# Altium schematic sheet RadioPod_2.SchDoc
size A4
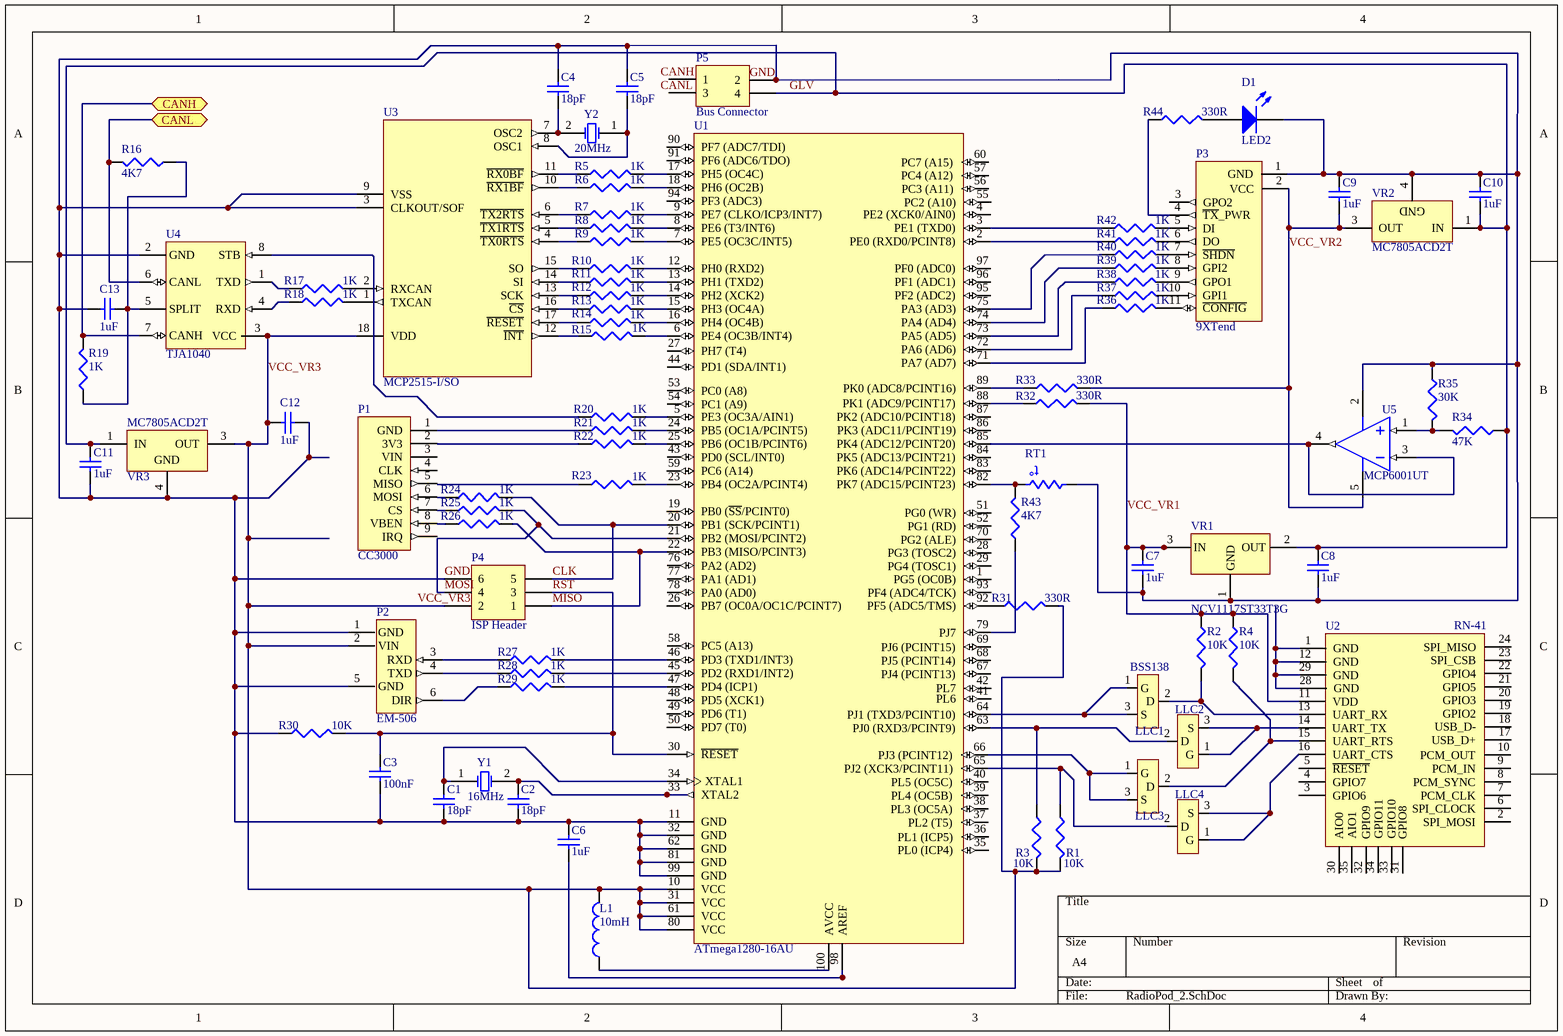
[diagram p0: RadioPod_2.SchDoc]

## Parts
C1  value 18pF  [1608[0603]]  (hidden comment: Cap Semi)
C2  value 18pF  [1608[0603]]  (hidden comment: Cap Semi)
C3  value 100nF  [1608[0603]]  (hidden comment: Cap Semi)
C4  value 18pF  [1608[0603]]  (hidden comment: Cap Semi)
C5  value 18pF  [1608[0603]]  (hidden comment: Cap Semi)
C6  value 1uF  [1608[0603]]  (hidden comment: Cap Semi)
C7  value 1uF  [1608[0603]]  (hidden comment: Cap Semi)
C8  value 1uF  [1608[0603]]  (hidden comment: Cap Semi)
C9  value 1uF  [1608[0603]]  (hidden comment: Cap Semi)
C10  value 1uF  [1608[0603]]  (hidden comment: Cap Semi)
C11  value 1uF  [1608[0603]]  (hidden comment: Cap Semi)
C12  value 1uF  [1608[0603]]  (hidden comment: Cap Semi)
C13  value 1uF  [1608[0603]]  (hidden comment: Cap Semi)
D1  LED2  [3.2X1.6X1.1]
L1  value 10mH  [0402-A]  (hidden comment: Inductor)
LLC1  BSS138  [SOT-23]
LLC2  BSS138  [SOT-23]  (value not drawn)
LLC3  BSS138  [SOT-23]  (value not drawn)
LLC4  BSS138  [SOT-23]  (value not drawn)
P1  CC3000  [hdr1X9]
P2  EM-506  [EM_506]
P3  9XTend  [9XTend Header]
P4  ISP Header  [HDR2X3]
P5  Bus Connector  [HDR2X2]
R1  value 10K  [J1-0603]  (hidden comment: Res3)
R2  value 10K  [J1-0603]  (hidden comment: Res3)
R3  value 10K  [J1-0603]  (hidden comment: Res3)
R4  value 10K  [J1-0603]  (hidden comment: Res3)
R5  value 1K  [J1-0603]  (hidden comment: Res3)
R6  value 1K  [J1-0603]  (hidden comment: Res3)
R7  value 1K  [J1-0603]  (hidden comment: Res3)
R8  value 1K  [J1-0603]  (hidden comment: Res3)
R9  value 1K  [J1-0603]  (hidden comment: Res3)
R10  value 1K  [J1-0603]  (hidden comment: Res3)
R11  value 1K  [J1-0603]  (hidden comment: Res3)
R12  value 1K  [J1-0603]  (hidden comment: Res3)
R13  value 1K  [J1-0603]  (hidden comment: Res3)
R14  value 1K  [J1-0603]  (hidden comment: Res3)
R15  value 1K  [J1-0603]  (hidden comment: Res3)
R16  value 4K7  [J1-0603]  (hidden comment: Res3)
R17  value 1K  [J1-0603]  (hidden comment: Res3)
R18  value 1K  [J1-0603]  (hidden comment: Res3)
R19  value 1K  [J1-0603]  (hidden comment: Res3)
R20  value 1K  [J1-0603]  (hidden comment: Res3)
R21  value 1K  [J1-0603]  (hidden comment: Res3)
R22  value 1K  [J1-0603]  (hidden comment: Res3)
R23  value 1K  [J1-0603]  (hidden comment: Res3)
R24  value 1K  [J1-0603]  (hidden comment: Res3)
R25  value 1K  [J1-0603]  (hidden comment: Res3)
R26  value 1K  [J1-0603]  (hidden comment: Res3)
R27  value 1K  [J1-0603]  (hidden comment: Res3)
R28  value 1K  [J1-0603]  (hidden comment: Res3)
R29  value 1K  [J1-0603]  (hidden comment: Res3)
R30  value 10K  [J1-0603]  (hidden comment: Res3)
R31  value 330R  [J1-0603]  (hidden comment: Res3)
R32  value 330R  [J1-0603]  (hidden comment: Res3)
R33  value 330R  [J1-0603]  (hidden comment: Res3)
R34  value 47K  [J1-0603]  (hidden comment: Res3)
R35  value 30K  [J1-0603]  (hidden comment: Res3)
R36  value 1K  [J1-0603]  (hidden comment: Res3)
R37  value 1K  [J1-0603]  (hidden comment: Res3)
R38  value 1K  [J1-0603]  (hidden comment: Res3)
R39  value 1K  [J1-0603]  (hidden comment: Res3)
R40  value 1K  [J1-0603]  (hidden comment: Res3)
R41  value 1K  [J1-0603]  (hidden comment: Res3)
R42  value 1K  [J1-0603]  (hidden comment: Res3)
R43  value 4K7  [J1-0603]  (hidden comment: Res3)
R44  value 330R  [J1-0603]  (hidden comment: Res3)
RT1  Res Thermal  [6-0805_N]  (value not drawn)
U1  ATmega1280-16AU  [100A_N]
U2  RN-41  [RN41]
U3  MCP2515-I/SO  [SOIC-SO18_N]
U4  TJA1040  [SO8_L]
U5  MCP6001UT  [SOT-23-OT5_N]
VR1  NCV1117ST33T3G  [SOT223_M]
VR2  MC7805ACD2T  [936-03]
VR3  MC7805ACD2T  [936-03]
Y1  16MHz  [R38]
Y2  20MHz  [R38]

## Ports
CANH (bidir), CANL (bidir)

## Nets
CANH: R19.2 U4.7(CANH) ; port CANH
CANL: R16.2 U4.6(CANL) ; port CANL
CLK: P4.5 R24.2 U1.20(PB1_(SCK/PCINT1))
GLV: C8.2 C10.1 C11.2 P5.4 R34.1 VR1.2(OUT) VR2.1(IN) VR3.1(IN)
GND: C1.1 C2.1 C3.1 C4.2 C5.2 C6.2 C7.1 C8.1 C9.2 C10.2 C11.1 C12.1 C13.1 D1.2(K) P2.1(GND) P2.5(GND) P3.1(GND) P4.6 P5.2 R30.1 R35.1 RT1.2 U1.11(GND) U1.32(GND) U1.62(GND) U1.81(GND) U1.99(GND) U3.3(CLKOUT/SOF) U3.9(VSS) U4.2(GND) U5.2(VSS) VR1.1(GND) VR2.4(GND) VR3.4(GND)
MISO: P4.1 R26.2 U1.22(PB3_(MISO/PCINT3))
MOSI: P4.4 R25.2 U1.21(PB2_(MOSI/PCINT2))
RST: C3.2 P4.3 R30.2 U1.30(~{RESET})
VCC_VR1: C7.2 R2.1 R4.1 R32.2 U2.11(VDD) VR1.3(IN)
VCC_VR2: C9.1 P3.2(VCC) R33.2 U5.5(VDD) VR2.3(OUT)
VCC_VR3: C12.2 L1.2 P2.2(VIN) P4.2 R1.2 R3.2 R31.2 U1.10(VCC) U1.31(VCC) U1.61(VCC) U1.80(VCC) U3.18(VDD) U4.3(VCC) VR3.3(OUT)
NetC1_2: C1.2 U1.34(XTAL1) Y1.1(OSC1)
NetC2_2: C2.2 U1.33(XTAL2) Y1.2(OSC2)
NetC4_1: C4.1 U3.7(OSC2) Y2.2(OSC2)
NetC5_1: C5.1 U3.8(OSC1) Y2.1(OSC1)
NetC6_1: C6.1 U1.98(AREF)
NetC13_2: C13.2 R16.1 R19.1 U4.5(SPLIT)
NetD1_1: D1.1(A) R44.2
NetL1_1: L1.1 U1.100(AVCC)
NetLLC1_1: LLC1.1(G) LLC1.3(S) U1.64(PJ1_(TXD3/PCINT10))
NetLLC1_2: LLC1.2(D) R2.2 U2.13(UART_RX)
NetLLC2_1: LLC2.1(G) LLC2.3(S) U2.14(UART_TX)
NetLLC2_2: LLC2.2(D) R3.1 U1.63(PJ0_(RXD3/PCINT9))
NetLLC3_1: LLC3.1(G) LLC3.3(S) U1.66(PJ3_(PCINT12))
NetLLC3_2: LLC3.2(D) R4.2 U2.15(UART_RTS)
NetLLC4_1: LLC4.1(G) LLC4.3(S) U2.16(UART_CTS)
NetLLC4_2: LLC4.2(D) R1.1 U1.65(PJ2_(XCK3/PCINT11))
NetP1_1: P1.1(GND) R21.1
NetP1_2: P1.2(3V3) R22.1
NetP1_6: P1.6(MOSI) R24.1
NetP1_7: P1.7(CS) R25.1
NetP1_8: P1.8(VBEN) R26.1
NetP2_3: P2.3(RXD) R27.1
NetP2_4: P2.4(TXD) R28.1
NetP2_6: P2.6(DIR) R29.1
NetP3_4: P3.4(~{TX}_PWR) R44.1
NetP3_5: P3.5(DI) R42.2
NetP3_6: P3.6(DO) R41.2
NetP3_7: P3.7(~{SHDN}) R40.2
NetP3_8: P3.8(GPI2) R39.2
NetP3_9: P3.9(GPO1) R38.2
NetP3_10: P3.10(GPI1) R37.2
NetP3_11: P3.11(~{CONFIG}) R36.2
NetR5_1: R5.1 U3.11(~{RX0BF})
NetR5_2: R5.2 U1.17(PH5_(OC4C))
NetR6_1: R6.1 U3.10(~{RX1BF})
NetR6_2: R6.2 U1.18(PH6_(OC2B))
NetR7_1: R7.1 U3.6(~{TX2RTS})
NetR7_2: R7.2 U1.9(PE7_(CLKO/ICP3/INT7))
NetR8_1: R8.1 U3.5(~{TX1RTS})
NetR8_2: R8.2 U1.8(PE6_(T3/INT6))
NetR9_1: R9.1 U3.4(~{TX0RTS})
NetR9_2: R9.2 U1.7(PE5_(OC3C/INT5))
NetR10_1: R10.1 U3.15(SO)
NetR10_2: R10.2 U1.12(PH0_(RXD2))
NetR11_1: R11.1 U3.14(SI)
NetR11_2: R11.2 U1.13(PH1_(TXD2))
NetR12_1: R12.1 U3.13(SCK)
NetR12_2: R12.2 U1.14(PH2_(XCK2))
NetR13_1: R13.1 U3.16(~{CS})
NetR13_2: R13.2 U1.15(PH3_(OC4A))
NetR14_1: R14.1 U3.17(~{RESET})
NetR14_2: R14.2 U1.16(PH4_(OC4B))
NetR15_1: R15.1 U3.12(~{INT})
NetR15_2: R15.2 U1.6(PE4_(OC3B/INT4))
NetR17_1: R17.1 U4.1(TXD)
NetR17_2: R17.2 U3.2(RXCAN)
NetR18_1: R18.1 U4.4(RXD)
NetR18_2: R18.2 U3.1(TXCAN)
NetR20_1: R20.1 U4.8(STB)
NetR20_2: R20.2 U1.5(PE3_(OC3A/AIN1))
NetR21_2: R21.2 U1.24(PB5_(OC1A/PCINT5))
NetR22_2: R22.2 U1.25(PB6_(OC1B/PCINT6))
NetR23_2: R23.2 U1.23(PB4_(OC2A/PCINT4))
NetR27_2: R27.2 U1.46(PD3_(TXD1/INT3))
NetR28_2: R28.2 U1.45(PD2_(RXD1/INT2))
NetR29_2: R29.2 U1.47(PD4_(ICP1))
NetR31_1: R31.1 U1.92(PF5_(ADC5/TMS))
NetR32_1: R32.1 U1.88(PK1_(ADC9/PCINT17))
NetR33_1: R33.1 U1.89(PK0_(ADC8/PCINT16))
NetR34_2: R34.2 R35.2 U5.1(VIN+)
NetR36_1: R36.1 U1.71(PA7_(AD7))
NetR37_1: R37.1 U1.72(PA6_(AD6))
NetR38_1: R38.1 U1.73(PA5_(AD5))
NetR39_1: R39.1 U1.74(PA4_(AD4))
NetR40_1: R40.1 U1.75(PA3_(AD3))
NetR41_1: R41.1 U1.2(PE0_(RXD0/PCINT8))
NetR42_1: R42.1 U1.3(PE1_(TXD0))
NetR43_1: R43.1 U1.79(PJ7)
NetR43_2: R43.2 RT1.1 U1.82(PK7_(ADC15/PCINT23))
NetU1_85: U1.85(PK4_(ADC12/PCINT20)) U5.3(VIN-) U5.4(VOUT)
NetU2_1: U2.1(GND) U2.12(GND) U2.28(GND) U2.29(GND)

Not connected (* = marked no-connect by the designer): P1 3(VIN) 4(CLK) 5(MISO) 9(IRQ); P3 3(GPO2); P5 1 3; R23 1; U1 1(PG5_(OC0B)) 4(PE2_(XCK0/AIN0)) 19(PB0_(~{SS}/PCINT0)) 26(PB7_(OC0A/OC1C/PCINT7)) 27(PH7_(T4)) 28(PG3_(TOSC2)) 29(PG4_(TOSC1)) 35(PL0_(ICP4)) 36(PL1_(ICP5)) 37(PL2_(T5)) 38(PL3_(OC5A)) 39(PL4_(OC5B)) 40(PL5_(OC5C)) 41(PL6) 42(PL7) 43(PD0_(SCL/INT0)) 44(PD1_(SDA/INT1)) 48(PD5_(XCK1)) 49(PD6_(T1)) 50(PD7_(T0)) 51(PG0_(WR)) 52(PG1_(RD)) 53(PC0_(A8)) 54(PC1_(A9)) 55(PC2_(A10)) 56(PC3_(A11)) 57(PC4_(A12)) 58(PC5_(A13)) 59(PC6_(A14)) 60(PC7_(A15)) 67(PJ4_(PCINT13)) 68(PJ5_(PCINT14)) 69(PJ6_(PCINT15)) 70(PG2_(ALE)) 76(PA2_(AD2)) 77(PA1_(AD1)) 78(PA0_(AD0)) 83(PK6_(ADC14/PCINT22)) 84(PK5_(ADC13/PCINT21)) 86(PK3_(ADC11/PCINT19)) 87(PK2_(ADC10/PCINT18)) 90(PF7_(ADC7/TDI)) 91(PF6_(ADC6/TDO)) 93(PF4_(ADC4/TCK)) 94(PF3_(ADC3)) 95(PF2_(ADC2)) 96(PF1_(ADC1)) 97(PF0_(ADC0)); U2 2(SPI_MOSI) 3(GPIO6) 4(GPIO7) 5(~{RESET}) 6(SPI_CLOCK) 7(PCM_CLK) 8(PCM_SYNC) 9(PCM_IN) 10(PCM_OUT) 17(USB_D+) 18(USB_D-) 19(GPIO2) 20(GPIO3) 21(GPIO5) 22(GPIO4) 23(SPI_CSB) 24(SPI_MISO) 30(AIO0) 31(GPIO8) 32(GPIO9) 33(GPIO10) 34(GPIO11) 35(AIO1); VR1 4

## Notes on the sheet
- Labels drawn without touching a wire or pin: CANH, CANL, GND
- (in symbol Res Thermal) t°

## Library data of the parts
C1-C13 = Cap Semi: Capacitor (Semiconductor SIM Model); Published: 8-Jun-2000; LatestRevisionDate: 29-May-2009; LatestRevisionNote: IPC-7351 Footprint Added.; PackageReference: C1206; Publisher: Altium Limited; PackageDescription: Chip Capacitor
D1 = LED2: Typical RED, GREEN, YELLOW, AMBER GaAs LED; Published: 8-Jun-2000; LatestRevisionDate: 17-Jul-2002; LatestRevisionNote: Re-released for DXP Platform.; PackageVersion: Feb-2002; PackageReference: 3.2X1.6X1.1; Publisher: Altium Limited; PackageDescription: SM LED; 2 Flat Leads
L1 = Inductor: Code_IEC: 1005; Published: 8-Jun-2000; LatestRevisionDate: 29-May-2009; LatestRevisionNote: IPC-7351 Footprint Added.; PackageReference: 0402-A; Publisher: Altium Limited; PackageDescription: Chip Inductor; Code_JEITA: 0402
LLC1-LLC4 = BSS138: BSS138 Logic Level Enhancement Mode FET
P1 = CC3000: CC3000 Wifi Module
P2 = EM-506: EM-506 GPS Module Pads
P3 = 9XTend: 9XTend Header Pins
P4 = Header 3X2: Header, 3-Pin, Dual row; LatestRevisionDate: 17-Jul-2002; LatestRevisionNote: Re-released for DXP Platform.; Publisher: Altium Limited
P5 = Header 2X2: Header, 2-Pin, Dual row; LatestRevisionDate: 17-Jul-2002; LatestRevisionNote: Re-released for DXP Platform.; Publisher: Altium Limited
R1-R44 = Res3: Resistor; Published: 8-Jun-2000; LatestRevisionDate: 29-May-2009; LatestRevisionNote: IPC-7351 Footprint Added.; PackageReference: J1-0603; Publisher: Altium Limited; PackageDescription: Chip Resistor
RT1 = Res Thermal: Thermistor; Published: 24-Mar-1999; LatestRevisionDate: 29-May-2009; LatestRevisionNote: IPC-7351 Footprint Added.; PackageVersion: Mar-2003; PackageReference: 6-0805; Publisher: Altium Limited; PackageDescription: Chip Resistor 0805 Case Size; Code_IPC: RESC2012
U1 = ATmega1280-16AU: 8-bit AVR Microcontroller, 2.7-5.5V, 128KB Flash, 4KB EEPROM, 8KB SRAM, 86 GPIO pins, 100-pin TQFP, Industrial Grade (-40°C to 85°C), Pb-Free; Published: 1-Apr-2010; DatasheetVersion: revL, Aug-2007; PackageVersion: revC, Oct-2001; PackageReference: 100A; Publisher: Altium Limited; PackageDescription: 100-Pin Thin Profile Plastic Quad Flat Pack (TQFP), 14 x 14 x 1.0 mm Body, 0.5 mm Pitch; Supplier 1: Digi-Key; Supplier Part Number 1: ATMEGA1280-16AU-ND; Supplier 2: Farnell; Supplier Part Number 2: 1455090; Supplier 3: Mouser; Supplier Part Number 3: 556-ATMEGA1280-16AU; Code_JEDEC: MS-026-AED; ComponentLink1Description: Manufacturer Link; ComponentLink1URL: http://www.atmel.com/products/avr/default.asp?; ComponentLink2Description: ATmega640/1280/1281/2560/2561 Datasheet; ComponentLink2URL: http://www.atmel.com/dyn/resources/prod_documents/doc2549.pdf; ComponentLink3Description: ATmega640/1280/1281/2560/2561 Summary; ComponentLink3URL: http://www.atmel.com/dyn/resources/prod_documents/2549S.pdf; ComponentLink4Description: Atmel.com Home; ComponentLink4URL: http://www.atmel.com
U2 = RN41: RN-41 Bluetooth Module
U3 = MCP2515-I/SO: Stand-Alone CAN Controller With SPI Interface, 18-Pin SOIC, Industrial Temperature; Published: 29-Jan-2009; DatasheetVersion: revE, Nov-2007; PackageVersion: revBB, Aug-2009; PackageReference: SOIC-SO18; Publisher: Altium Limited; PackageDescription: 18-Lead Plastic Small Outline (SO) - Wide 7.50mm Body [SOIC]; Supplier 1: Digi-Key; Supplier Part Number 1: MCP2515-I/SO-ND; Supplier 2: Farnell; Supplier Part Number 2: 1292239; Code_JEDEC: MS-013; ComponentLink1Description: Datasheet; ComponentLink1URL: http://ww1.microchip.com/downloads/en/DeviceDoc/21801e.pdf; ComponentLink2Description: Packaging Specification; ComponentLink2URL: http://www.microchip.com/stellent/groups/techpub_sg/documents/packagingspec/en012702.pdf; ComponentLink3Description: Microchip.com Home; ComponentLink3URL: http://www.microchip.com/
U5 = MCP6001UT-I/OT: 1 MHz, Low-Power Operational Amplifier, 5-Pin SOT-23, Industrial Temperature, Tape and Reel; Published: 29-Jan-2009; LatestRevisionDate: 02-Dec-2009; LatestRevisionNote: Updated to datasheet revision J, Nov-2009; DatasheetVersion: revJ, Nov-2009; PackageVersion: revBB, Aug-2009; PackageReference: SOT-23-OT5; Publisher: Altium Limited; PackageDescription: 5-Lead Plastic Small Outline Transistor (OT) [SOT-23]; Supplier 1: Digi-Key; Supplier Part Number 1: MCP6001UT-I/OTTR-ND; Supplier 2: Digi-Key; Supplier Part Number 2: MCP6001UT-I/OTCT-ND; Supplier 3: Digi-Key; Supplier Part Number 3: MCP6001UT-I/OTDKR-ND; Supplier 4: Farnell; Supplier Part Number 4: 8540845; Code_IPC: SOT23-5; ComponentLink1Description: Datasheet; ComponentLink1URL: http://ww1.microchip.com/downloads/en/DeviceDoc/21733j.pdf; ComponentLink2Description: Packaging Specification; ComponentLink2URL: http://www.microchip.com/stellent/groups/techpub_sg/documents/packagingspec/en012702.pdf; ComponentLink3Description: Microchip.com Home; ComponentLink3URL: http://www.microchip.com/
VR2 VR3 = MC7805ACD2T: Three-Terminal Positive Voltage Regulator; Note: Pin 2 is electrically connected to Pin 4; Pin 2 is trimmed and not drawn;; Published: 15-Apr-2002; DatasheetVersion: 1997; PackageVersion: 1997; PackageReference: 936-03; Publisher: Altium Limited; PackageDescription: D2-PAK/TO-263-AB; 3 Leads (1 Cropped); Body 14.7 (inc. leads) x 10.2 mm (LxW max); ComponentLink1Description: Manufacturer Link; ComponentLink1URL: http://www.onsemi.com/site/products/taxonomy/0,4438,503,00.html; ComponentLink2Description: Datasheet; ComponentLink2URL: http://www.onsemi.com/pub/Collateral/MC7800-D.PDF
Y1 Y2 = XTAL: Crystal Oscillator; Published: 8-Jun-2000; LatestRevisionDate: 17-Jul-2002; LatestRevisionNote: Re-released for DXP Platform.; PackageReference: R38; Publisher: Altium Limited; PackageDescription: Crystal, Thru-Hole; 2 Leads; Body 3.1 x 8.2 mm (Dia.xH)
VR1 = NCV1117ST33T3G: Package Description: SOT−223